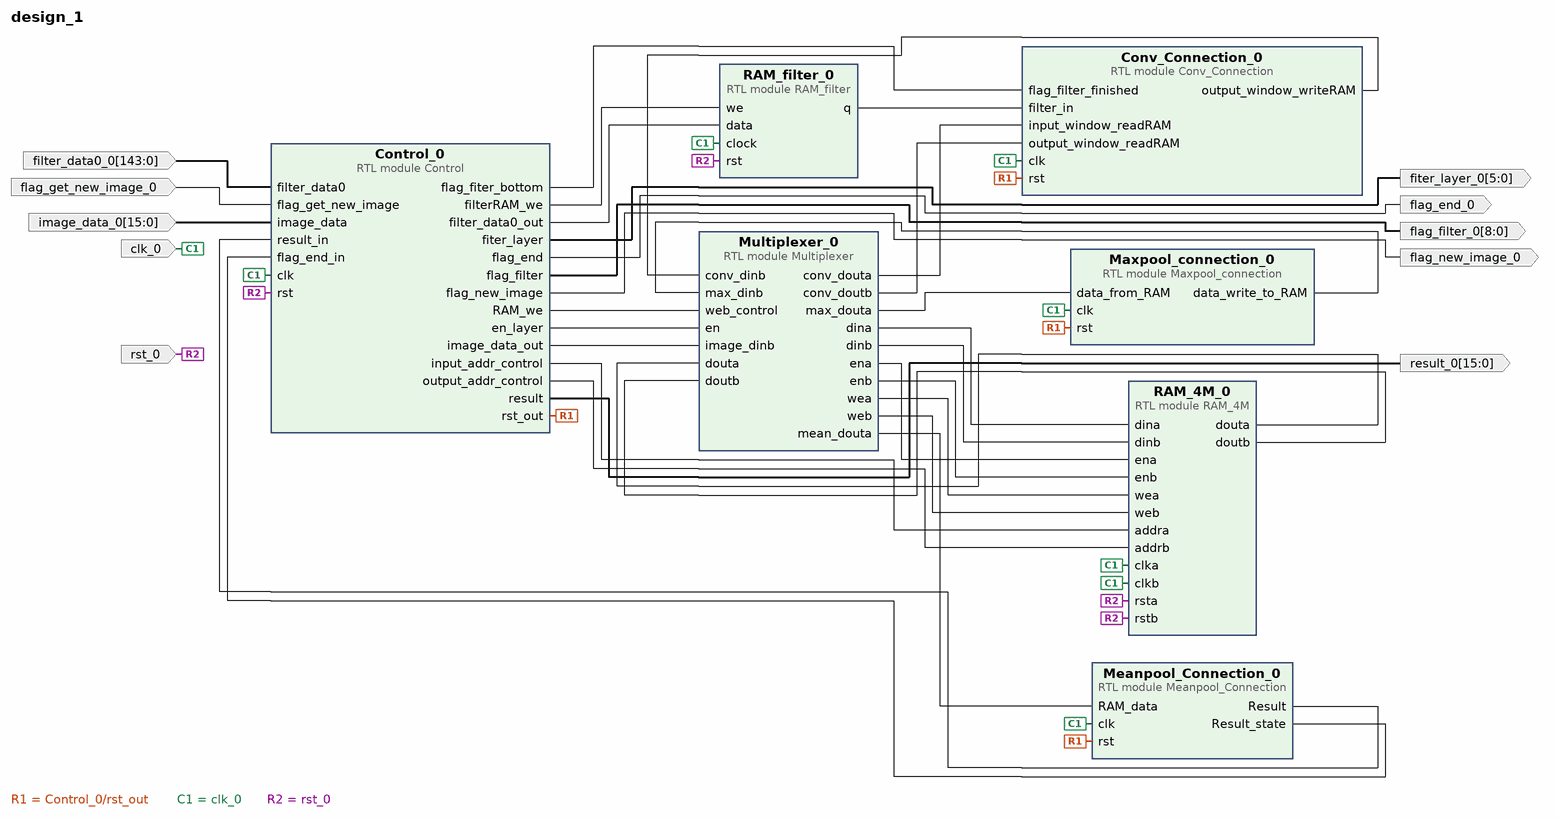
[diagram p0: block diagram of the top level]
# Vivado block design design_1, xc7z020clg484-1, Vivado 2021.1
create_bd_design design_1

create_bd_port -dir O -from 5 -to 0 fiter_layer_0
create_bd_port -dir O flag_end_0
create_bd_port -dir O -from 8 -to 0 flag_filter_0
create_bd_port -dir O flag_new_image_0
create_bd_port -dir O -from 15 -to 0 result_0
create_bd_port -dir I -from 143 -to 0 filter_data0_0
create_bd_port -dir I -from 15 -to 0 image_data_0
create_bd_port -dir I flag_get_new_image_0
create_bd_port -dir I -type clk clk_0
create_bd_port -dir I -type rst rst_0

create_bd_cell -type module -reference RAM_4M RAM_4M_0
create_bd_cell -type module -reference Maxpool_connection Maxpool_connection_0
create_bd_cell -type module -reference RAM_filter RAM_filter_0
create_bd_cell -type module -reference Multiplexer Multiplexer_0
create_bd_cell -type module -reference Meanpool_Connection Meanpool_Connection_0
create_bd_cell -type module -reference Conv_Connection Conv_Connection_0
create_bd_cell -type module -reference Control Control_0

# ---- connections ----

connect_bd_net [get_bd_pins Control_0/RAM_we] [get_bd_pins Multiplexer_0/web_control]
connect_bd_net [get_bd_pins Control_0/en_layer] [get_bd_pins Multiplexer_0/en]
connect_bd_net [get_bd_pins Control_0/filterRAM_we] [get_bd_pins RAM_filter_0/we]
connect_bd_net [get_bd_pins Control_0/filter_data0_out] [get_bd_pins RAM_filter_0/data]
connect_bd_net [get_bd_pins Control_0/fiter_layer] [get_bd_ports fiter_layer_0]
connect_bd_net [get_bd_pins Control_0/flag_end] [get_bd_ports flag_end_0]
connect_bd_net [get_bd_pins Control_0/flag_filter] [get_bd_ports flag_filter_0]
connect_bd_net [get_bd_pins Control_0/flag_fiter_bottom] [get_bd_pins Conv_Connection_0/flag_filter_finished]
connect_bd_net [get_bd_pins Control_0/flag_new_image] [get_bd_ports flag_new_image_0]
connect_bd_net [get_bd_pins Control_0/image_data_out] [get_bd_pins Multiplexer_0/image_dinb]
connect_bd_net [get_bd_pins Control_0/input_addr_control] [get_bd_pins RAM_4M_0/addra]
connect_bd_net [get_bd_pins Control_0/output_addr_control] [get_bd_pins RAM_4M_0/addrb]
connect_bd_net [get_bd_pins Control_0/result] [get_bd_ports result_0]
connect_bd_net [get_bd_pins Control_0/rst_out] \
  [get_bd_pins Maxpool_connection_0/rst] [get_bd_pins Meanpool_Connection_0/rst] [get_bd_pins Conv_Connection_0/rst]
connect_bd_net [get_bd_pins Conv_Connection_0/output_window_writeRAM] [get_bd_pins Multiplexer_0/conv_dinb]
connect_bd_net [get_bd_pins Maxpool_connection_0/data_write_to_RAM] [get_bd_pins Multiplexer_0/max_dinb]
connect_bd_net [get_bd_pins Meanpool_Connection_0/Result] [get_bd_pins Control_0/result_in]
connect_bd_net [get_bd_pins Meanpool_Connection_0/Result_state] [get_bd_pins Control_0/flag_end_in]
connect_bd_net [get_bd_pins Multiplexer_0/conv_douta] [get_bd_pins Conv_Connection_0/input_window_readRAM]
connect_bd_net [get_bd_pins Multiplexer_0/conv_doutb] [get_bd_pins Conv_Connection_0/output_window_readRAM]
connect_bd_net [get_bd_pins Multiplexer_0/dina] [get_bd_pins RAM_4M_0/dina]
connect_bd_net [get_bd_pins Multiplexer_0/dinb] [get_bd_pins RAM_4M_0/dinb]
connect_bd_net [get_bd_pins Multiplexer_0/ena] [get_bd_pins RAM_4M_0/ena]
connect_bd_net [get_bd_pins Multiplexer_0/enb] [get_bd_pins RAM_4M_0/enb]
connect_bd_net [get_bd_pins Multiplexer_0/max_douta] [get_bd_pins Maxpool_connection_0/data_from_RAM]
connect_bd_net [get_bd_pins Multiplexer_0/mean_douta] [get_bd_pins Meanpool_Connection_0/RAM_data]
connect_bd_net [get_bd_pins Multiplexer_0/wea] [get_bd_pins RAM_4M_0/wea]
connect_bd_net [get_bd_pins Multiplexer_0/web] [get_bd_pins RAM_4M_0/web]
connect_bd_net [get_bd_pins RAM_4M_0/douta] [get_bd_pins Multiplexer_0/douta]
connect_bd_net [get_bd_pins RAM_4M_0/doutb] [get_bd_pins Multiplexer_0/doutb]
connect_bd_net [get_bd_pins RAM_filter_0/q] [get_bd_pins Conv_Connection_0/filter_in]
connect_bd_net -net clk_0_1 [get_bd_ports clk_0] \
  [get_bd_pins RAM_4M_0/clka] [get_bd_pins RAM_4M_0/clkb] [get_bd_pins Maxpool_connection_0/clk] \
  [get_bd_pins RAM_filter_0/clock] [get_bd_pins Meanpool_Connection_0/clk] [get_bd_pins Conv_Connection_0/clk] \
  [get_bd_pins Control_0/clk]
connect_bd_net -net filter_data0_0_1 [get_bd_ports filter_data0_0] [get_bd_pins Control_0/filter_data0]
connect_bd_net -net flag_get_new_image_0_1 [get_bd_ports flag_get_new_image_0] [get_bd_pins Control_0/flag_get_new_image]
connect_bd_net -net image_data_0_1 [get_bd_ports image_data_0] [get_bd_pins Control_0/image_data]
connect_bd_net -net rst_0_1 [get_bd_ports rst_0] \
  [get_bd_pins RAM_4M_0/rsta] [get_bd_pins RAM_4M_0/rstb] [get_bd_pins RAM_filter_0/rst] [get_bd_pins Control_0/rst]

validate_bd_design
save_bd_design
